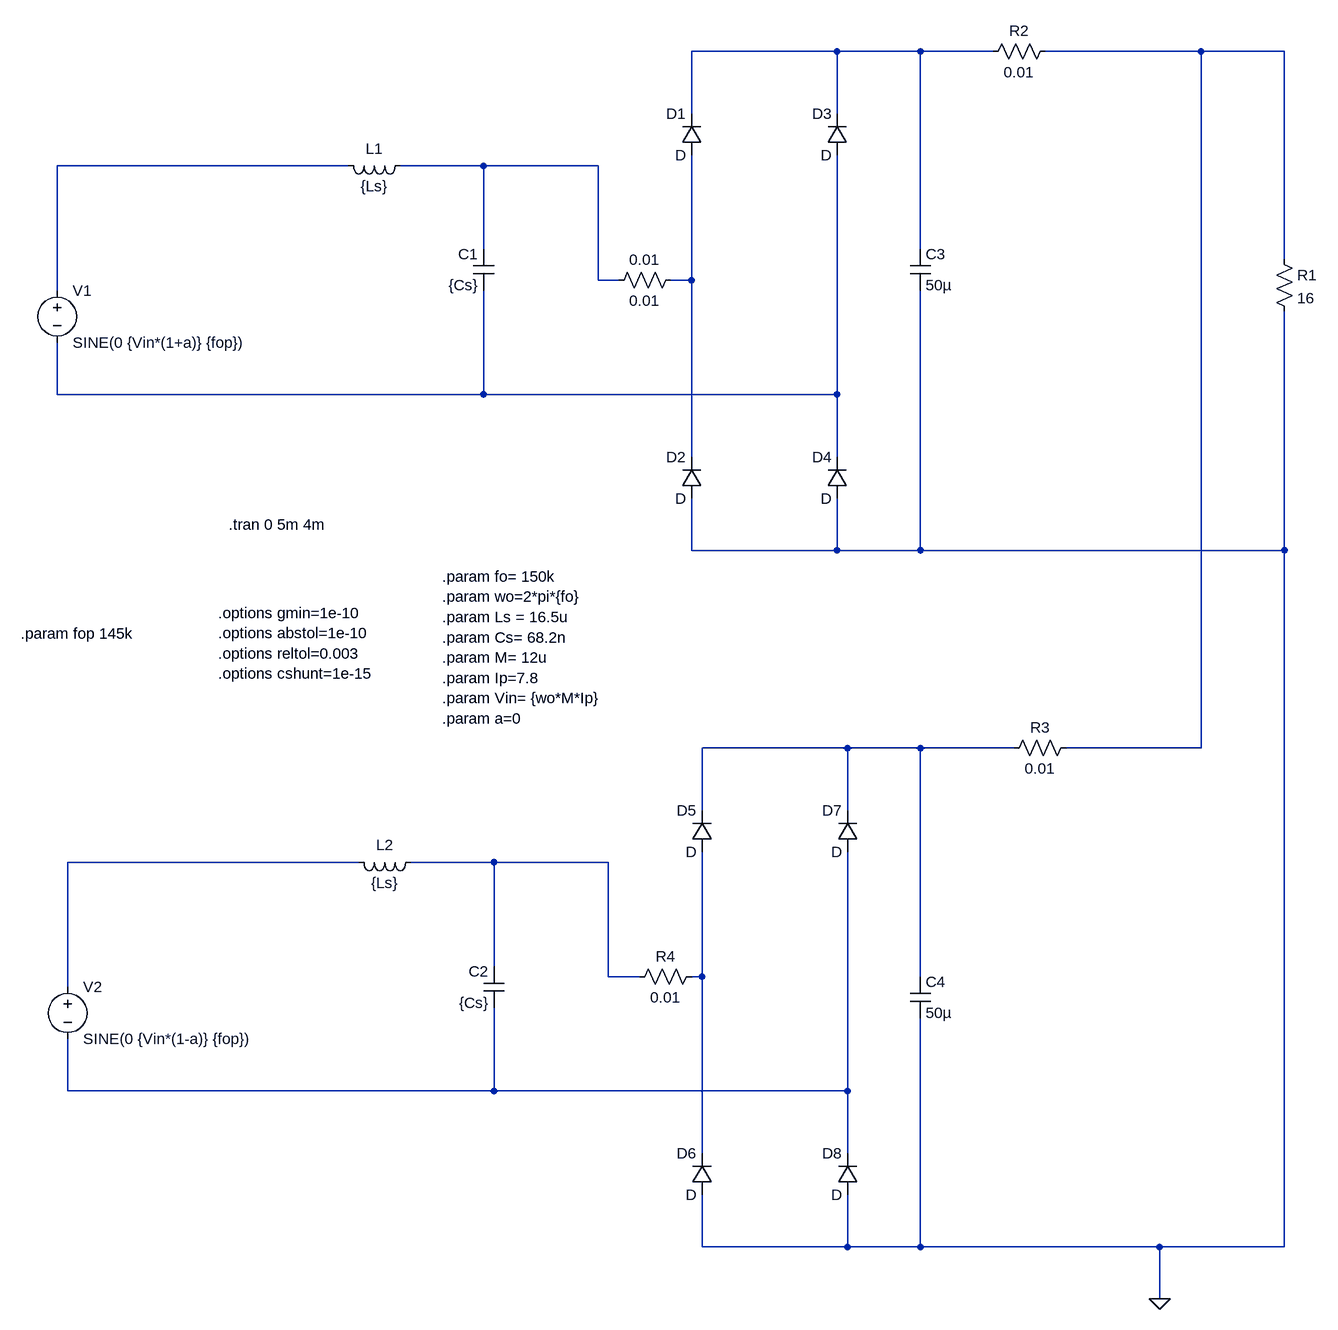
[diagram p0: schematic paralel-compensation-parellel_Tx-Rx.asc]
paralel-compensation-parellel_Tx-Rx.asc, the LTspice schematic file:
Version 4
SHEET 1 2752 1872
WIRE 1936 -240 1712 -240
WIRE 2064 -240 1936 -240
WIRE 2176 -240 2064 -240
WIRE 2496 -240 2256 -240
WIRE 2624 -240 2496 -240
WIRE 1712 -144 1712 -240
WIRE 1936 -144 1936 -240
WIRE 1184 -64 736 -64
WIRE 1392 -64 1264 -64
WIRE 1568 -64 1392 -64
WIRE 1392 64 1392 -64
WIRE 2064 64 2064 -240
WIRE 2624 80 2624 -240
WIRE 1568 112 1568 -64
WIRE 1600 112 1568 112
WIRE 1712 112 1712 -80
WIRE 1712 112 1680 112
WIRE 736 128 736 -64
WIRE 736 288 736 208
WIRE 1392 288 1392 128
WIRE 1392 288 736 288
WIRE 1936 288 1936 -80
WIRE 1936 288 1392 288
WIRE 1712 384 1712 112
WIRE 1936 384 1936 288
WIRE 1712 528 1712 448
WIRE 1936 528 1936 448
WIRE 1936 528 1712 528
WIRE 2064 528 2064 128
WIRE 2064 528 1936 528
WIRE 2624 528 2624 160
WIRE 2624 528 2064 528
WIRE 1952 832 1728 832
WIRE 2064 832 1952 832
WIRE 2208 832 2064 832
WIRE 2496 832 2496 -240
WIRE 2496 832 2288 832
WIRE 1728 928 1728 832
WIRE 1952 928 1952 832
WIRE 1200 1008 752 1008
WIRE 1408 1008 1280 1008
WIRE 1584 1008 1408 1008
WIRE 1408 1168 1408 1008
WIRE 1584 1184 1584 1008
WIRE 1632 1184 1584 1184
WIRE 1728 1184 1728 992
WIRE 1728 1184 1712 1184
WIRE 2064 1184 2064 832
WIRE 752 1200 752 1008
WIRE 752 1360 752 1280
WIRE 1408 1360 1408 1232
WIRE 1408 1360 752 1360
WIRE 1952 1360 1952 992
WIRE 1952 1360 1408 1360
WIRE 1728 1456 1728 1184
WIRE 1952 1456 1952 1360
WIRE 1728 1600 1728 1520
WIRE 1952 1600 1952 1520
WIRE 1952 1600 1728 1600
WIRE 2064 1600 2064 1248
WIRE 2064 1600 1952 1600
WIRE 2432 1600 2064 1600
WIRE 2624 1600 2624 528
WIRE 2624 1600 2432 1600
WIRE 2432 1680 2432 1600
FLAG 2432 1680 0
SYMBOL voltage 736 112 R0
WINDOW 123 0 0 Left 0
WINDOW 39 0 0 Left 0
SYMATTR InstName V1
SYMATTR Value SINE(0 {Vin*(1+a)} {fop})
SYMBOL ind 1280 -80 R90
WINDOW 0 5 56 VBottom 2
WINDOW 3 32 56 VTop 2
SYMATTR InstName L1
SYMATTR Value {Ls}
SYMBOL cap 1408 128 R180
WINDOW 0 24 56 Left 2
WINDOW 3 24 8 Left 2
SYMATTR InstName C1
SYMATTR Value {Cs}
SYMBOL diode 1728 -80 R180
WINDOW 0 24 64 Left 2
WINDOW 3 24 0 Left 2
SYMATTR InstName D1
SYMBOL diode 1728 448 R180
WINDOW 0 24 64 Left 2
WINDOW 3 24 0 Left 2
SYMATTR InstName D2
SYMBOL diode 1952 -80 R180
WINDOW 0 24 64 Left 2
WINDOW 3 24 0 Left 2
SYMATTR InstName D3
SYMBOL diode 1952 448 R180
WINDOW 0 24 64 Left 2
WINDOW 3 24 0 Left 2
SYMATTR InstName D4
SYMBOL res 2608 64 R0
SYMATTR InstName R1
SYMATTR Value 16
SYMBOL voltage 752 1184 R0
WINDOW 123 0 0 Left 0
WINDOW 39 0 0 Left 0
SYMATTR InstName V2
SYMATTR Value SINE(0 {Vin*(1-a)} {fop})
SYMBOL ind 1296 992 R90
WINDOW 0 5 56 VBottom 2
WINDOW 3 32 56 VTop 2
SYMATTR InstName L2
SYMATTR Value {Ls}
SYMBOL cap 1424 1232 R180
WINDOW 0 24 56 Left 2
WINDOW 3 24 8 Left 2
SYMATTR InstName C2
SYMATTR Value {Cs}
SYMBOL diode 1744 992 R180
WINDOW 0 24 64 Left 2
WINDOW 3 24 0 Left 2
SYMATTR InstName D5
SYMBOL diode 1744 1520 R180
WINDOW 0 24 64 Left 2
WINDOW 3 24 0 Left 2
SYMATTR InstName D6
SYMBOL diode 1968 992 R180
WINDOW 0 24 64 Left 2
WINDOW 3 24 0 Left 2
SYMATTR InstName D7
SYMBOL diode 1968 1520 R180
WINDOW 0 24 64 Left 2
WINDOW 3 24 0 Left 2
SYMATTR InstName D8
SYMBOL cap 2048 64 R0
SYMATTR InstName C3
SYMATTR Value 50µ
SYMBOL cap 2048 1184 R0
SYMATTR InstName C4
SYMATTR Value 50µ
SYMBOL res 2272 -256 R90
WINDOW 0 0 56 VBottom 2
WINDOW 3 32 56 VTop 2
SYMATTR InstName R2
SYMATTR Value 0.01
SYMBOL res 2304 816 R90
WINDOW 0 0 56 VBottom 2
WINDOW 3 32 56 VTop 2
SYMATTR InstName R3
SYMATTR Value 0.01
SYMBOL res 1728 1168 R90
WINDOW 0 0 56 VBottom 2
WINDOW 3 32 56 VTop 2
SYMATTR InstName R4
SYMATTR Value 0.01
SYMBOL res 1696 96 R90
WINDOW 0 0 56 VBottom 2
WINDOW 3 32 56 VTop 2
SYMATTR InstName 0.01
SYMATTR Value 0.01
TEXT 1000 488 Left 2 !.tran 0 5m 4m
TEXT 680 656 Left 2 !.param fop 145k
TEXT 1328 568 Left 2 !.param fo= 150k\n.param wo=2*pi*{fo}\n.param Ls = 16.5u\n.param Cs= 68.2n\n.param M= 12u\n.param Ip=7.8\n.param Vin= {wo*M*Ip}\n.param a=0
TEXT 984 624 Left 2 !.options gmin=1e-10\n.options abstol=1e-10\n.options reltol=0.003\n.options cshunt=1e-15

The netlist it stands for:
* paralel-compensation-parellel_Tx-Rx.asc
V1 N003 N006 SINE(0 {Vin*(1+a)} {fop})
L1 N004 N003 {Ls}
C1 N006 N004 {Cs}
D1 N005 N001 D
D2 0 N005 D
D3 N006 N001 D
D4 0 N006 D
R1 N002 0 16
V2 N008 N011 SINE(0 {Vin*(1-a)} {fop})
L2 N009 N008 {Ls}
C2 N011 N009 {Cs}
D5 N010 N007 D
D6 0 N010 D
D7 N011 N007 D
D8 0 N011 D
C3 N001 0 50µ
C4 N007 0 50µ
R2 N002 N001 0.01
R3 N002 N007 0.01
R4 N010 N009 0.01
R§0.01 N005 N004 0.01
.model D D
.lib standard.dio
.tran 0 5m 4m
.param fop 145k
.param fo= 150k
.param wo=2*pi*{fo}
.param Ls = 16.5u
.param Cs= 68.2n
.param M= 12u
.param Ip=7.8
.param Vin= {wo*M*Ip}
.param a=0
.options gmin=1e-10
.options abstol=1e-10
.options reltol=0.003
.options cshunt=1e-15
.backanno
.end